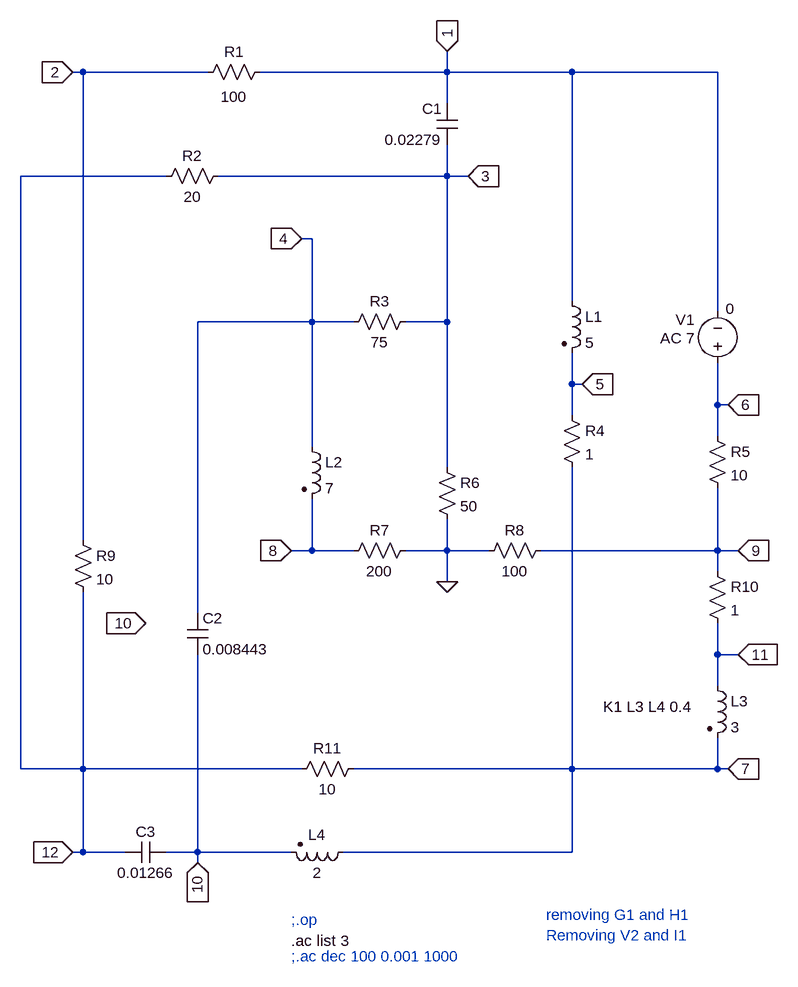
[diagram p0: schematic Superposition_and_polyphase_circuit_v-test.asc]
Superposition_and_polyphase_circuit_v-test.asc, the LTspice schematic file:
Version 4
SHEET 1 1604 848
WIRE -1424 -560 -1440 -560
WIRE -1232 -560 -1424 -560
WIRE -864 -560 -864 -592
WIRE -864 -560 -1152 -560
WIRE -672 -560 -864 -560
WIRE -448 -560 -672 -560
WIRE -864 -512 -864 -560
WIRE -1296 -400 -1520 -400
WIRE -864 -400 -864 -448
WIRE -864 -400 -1216 -400
WIRE -832 -400 -864 -400
WIRE -1072 -304 -1088 -304
WIRE -672 -208 -672 -560
WIRE -448 -192 -448 -560
WIRE -1072 -176 -1072 -304
WIRE -1072 -176 -1248 -176
WIRE -1008 -176 -1072 -176
WIRE -864 -176 -864 -400
WIRE -864 -176 -928 -176
WIRE -672 -80 -672 -128
WIRE -656 -80 -672 -80
WIRE -448 -48 -448 -112
WIRE -432 -48 -448 -48
WIRE -672 -32 -672 -80
WIRE -448 0 -448 -48
WIRE -1072 16 -1072 -176
WIRE -864 48 -864 -176
WIRE -1424 160 -1424 -560
WIRE -1072 176 -1072 96
WIRE -1072 176 -1104 176
WIRE -1008 176 -1072 176
WIRE -864 176 -864 128
WIRE -864 176 -928 176
WIRE -800 176 -864 176
WIRE -448 176 -448 80
WIRE -448 176 -720 176
WIRE -416 176 -448 176
WIRE -448 208 -448 176
WIRE -864 224 -864 176
WIRE -1248 272 -1248 -176
WIRE -448 336 -448 288
WIRE -416 336 -448 336
WIRE -448 384 -448 336
WIRE -1520 512 -1520 -400
WIRE -1424 512 -1424 240
WIRE -1424 512 -1520 512
WIRE -1088 512 -1424 512
WIRE -672 512 -672 48
WIRE -672 512 -1008 512
WIRE -448 512 -448 464
WIRE -448 512 -672 512
WIRE -432 512 -448 512
WIRE -1424 640 -1424 512
WIRE -1424 640 -1440 640
WIRE -1360 640 -1424 640
WIRE -1248 640 -1248 336
WIRE -1248 640 -1296 640
WIRE -1104 640 -1248 640
WIRE -672 640 -672 512
WIRE -672 640 -1024 640
WIRE -1248 656 -1248 640
FLAG -864 224 0
FLAG -864 -592 1
IOPIN -864 -592 In
FLAG -832 -400 3
IOPIN -832 -400 In
FLAG -1088 -304 4
IOPIN -1088 -304 In
FLAG -1104 176 8
IOPIN -1104 176 In
FLAG -416 176 9
IOPIN -416 176 In
FLAG -432 -48 6
IOPIN -432 -48 In
FLAG -656 -80 5
IOPIN -656 -80 In
FLAG -432 512 7
IOPIN -432 512 In
FLAG -1248 656 10
IOPIN -1248 656 In
FLAG -1440 640 12
IOPIN -1440 640 In
FLAG -416 336 11
IOPIN -416 336 In
FLAG -1328 288 10
IOPIN -1328 288 In
FLAG -1440 -560 2
IOPIN -1440 -560 In
SYMBOL voltage -448 -96 R180
WINDOW 0 35 83 Left 2
WINDOW 3 -26 100 Left 2
WINDOW 123 35 55 Left 2
WINDOW 39 0 0 Left 0
SYMATTR InstName V1
SYMATTR Value 0
SYMATTR Value2 AC 7
SYMBOL ind2 -464 368 R0
SYMATTR InstName L3
SYMATTR Value 3
SYMATTR Type ind
SYMATTR SpiceLine Rser=0
SYMBOL ind2 -688 -224 R0
SYMATTR InstName L1
SYMATTR Value 5
SYMATTR Type ind
SYMATTR SpiceLine Rser=0
SYMBOL ind2 -1008 624 R90
WINDOW 0 5 56 VBottom 2
WINDOW 3 32 56 VTop 2
SYMATTR InstName L4
SYMATTR Value 2
SYMATTR Type ind
SYMATTR SpiceLine Rser=0
SYMBOL ind2 -1088 0 R0
SYMATTR InstName L2
SYMATTR Value 7
SYMATTR Type ind
SYMATTR SpiceLine Rser=0
SYMBOL cap -848 -448 R180
WINDOW 0 24 56 Left 2
WINDOW 3 24 8 Left 2
SYMATTR InstName C1
SYMATTR Value 0.02279
SYMBOL cap -1264 272 R0
SYMATTR InstName C2
SYMATTR Value 0.008443
SYMBOL cap -1296 624 R90
WINDOW 0 0 32 VBottom 2
WINDOW 3 32 32 VTop 2
SYMATTR InstName C3
SYMATTR Value 0.01266
SYMBOL res -1440 144 R0
SYMATTR InstName R9
SYMATTR Value 10
SYMBOL res -880 32 R0
SYMATTR InstName R6
SYMATTR Value 50
SYMBOL res -688 -48 R0
SYMATTR InstName R4
SYMATTR Value 1
SYMBOL res -1136 -576 R90
WINDOW 0 0 56 VBottom 2
WINDOW 3 38 56 VTop 2
SYMATTR InstName R1
SYMATTR Value 100
SYMBOL res -912 -192 R90
WINDOW 0 0 56 VBottom 2
WINDOW 3 32 56 VTop 2
SYMATTR InstName R3
SYMATTR Value 75
SYMBOL res -912 160 R90
WINDOW 0 0 56 VBottom 2
WINDOW 3 32 56 VTop 2
SYMATTR InstName R7
SYMATTR Value 200
SYMBOL res -992 496 R90
WINDOW 0 0 56 VBottom 2
WINDOW 3 32 56 VTop 2
SYMATTR InstName R11
SYMATTR Value 10
SYMBOL res -464 -16 R0
SYMATTR InstName R5
SYMATTR Value 10
SYMBOL res -464 192 R0
SYMATTR InstName R10
SYMATTR Value 1
SYMBOL res -704 160 R90
WINDOW 0 0 56 VBottom 2
WINDOW 3 32 56 VTop 2
SYMATTR InstName R8
SYMATTR Value 100
SYMBOL res -1200 -416 R90
WINDOW 0 0 56 VBottom 2
WINDOW 3 32 56 VTop 2
SYMATTR InstName R2
SYMATTR Value 20
TEXT -1104 800 Left 2 ;;.ac dec 100 0.001 1000
TEXT -624 416 Left 2 !K1 L3 L4 0.4
TEXT -1104 776 Left 2 !.ac list 3
TEXT -1104 744 Left 2 ;;.op
TEXT -712 736 Left 2 ;removing G1 and H1
TEXT -712 768 Left 2 ;Removing V2 and I1

The netlist it stands for:
* Superposition_and_polyphase_circuit_v-test.asc
V1 6 1 0 AC 7
L3 11 7 3 Rser=0
L1 1 5 5 Rser=0
L4 7 10 2 Rser=0
L2 4 8 7 Rser=0
C1 3 1 0.02279
C2 4 10 0.008443
C3 10 12 0.01266
R9 2 12 10
R6 3 0 50
R4 5 7 1
R1 1 2 100
R3 3 4 75
R7 0 8 200
R11 7 12 10
R5 6 9 10
R10 9 11 1
R8 9 0 100
R2 3 12 20
* ;.ac dec 100 0.001 1000
K1 L3 L4 0.4
.ac list 3
* ;.op
* removing G1 and H1
* Removing V2 and I1
.backanno
.end